# Altium schematic sheet MainPower.SchDoc: Main / high power
size A4; Author: Hildo Guillardi Júnior; Organization: UNICAMP / LCEE; Address1: University of Campinas - Brazil; Address2: Power Conditioning Laboratory; Address3: Licensed by GNU GPL 3.0; ProjectName: Easy Inverter
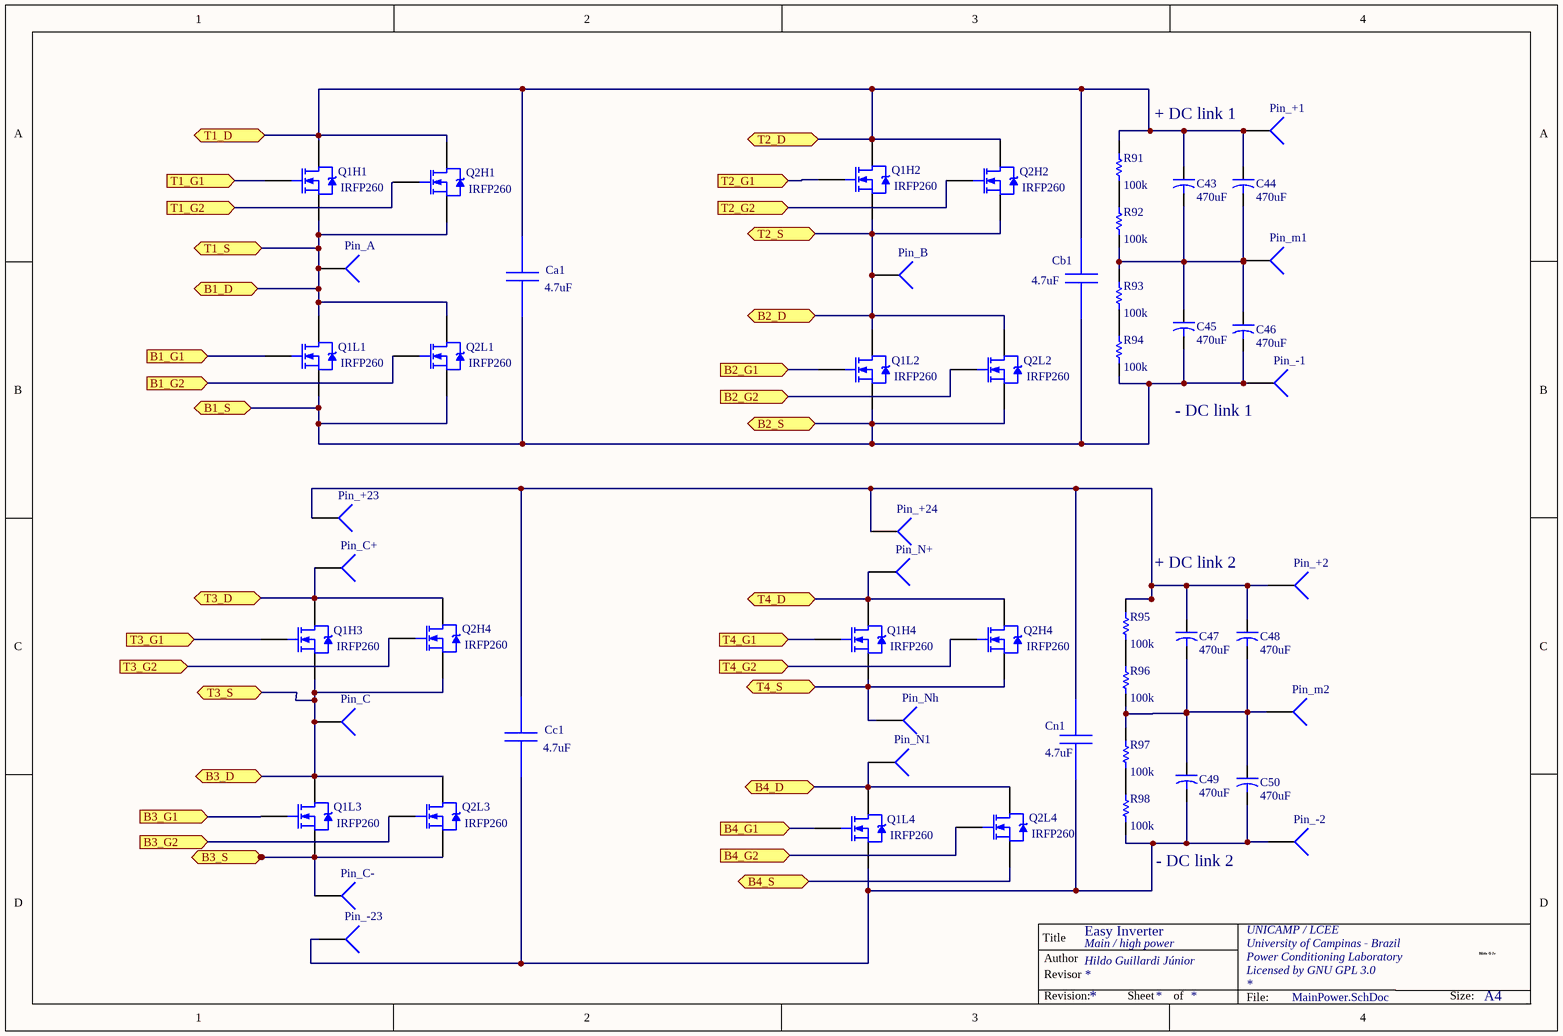
[diagram p0: MainPower.SchDoc]

## Parts
(Parts that share a designator on the sheet are numbered #1, #2 ... from top to bottom, then left to right.)
C43  value 470uF  [Capacitor Eletrolitico - duplicate]
C44  value 470uF  [Capacitor Eletrolitico - duplicate]
C45  value 470uF  [Capacitor Eletrolitico - duplicate]
C46  value 470uF  [Capacitor Eletrolitico - duplicate]
C47  value 470uF  [Capacitor Eletrolitico - duplicate]
C48  value 470uF  [Capacitor Eletrolitico - duplicate]
C49  value 470uF  [Capacitor Eletrolitico - duplicate]
C50  value 470uF  [Capacitor Eletrolitico - duplicate]
Ca1  value 4.7uF  [CApacitor SMD - 22uF]
Cb1  value 4.7uF  [CApacitor SMD - 22uF]
Cc1  value 4.7uF  [CApacitor SMD - 22uF]
Cn1  value 4.7uF  [CApacitor SMD - 22uF]
Pin_+1  (no value)  [Power conector]
Pin_+2  (no value)  [Power conector]
Pin_+23  (no value)  [Power conector]
Pin_+24  (no value)  [Power conector]
Pin_-1  (no value)  [Power conector]
Pin_-2  (no value)  [Power conector]
Pin_-23  (no value)  [Power conector]
Pin_A  (no value)  [Power conector]
Pin_B  (no value)  [Power conector]
Pin_C  (no value)
Pin_C+  (no value)  [Power conector]
Pin_C-  (no value)  [Power conector]
Pin_m1  (no value)  [Power conector]
Pin_m2  (no value)  [Power conector]
Pin_N1  (no value)  [Power conector]
Pin_N+  (no value)  [Power conector]
Pin_Nh  (no value)  [Power conector]
Q1H1  IRFP260  [TO227]
Q1H2  IRFP260  [TO227]
Q1H3  IRFP260  [TO227]
Q1H4  IRFP260  [TO227]
Q1L1  IRFP260  [TO227]
Q1L2  IRFP260  [TO227]
Q1L3  IRFP260  [TO227]
Q1L4  IRFP260  [TO227]
Q2H1  IRFP260  [TO227]
Q2H2  IRFP260  [TO227]
Q2H4#1  IRFP260  [TO227]
Q2H4#2  IRFP260  [TO227]
Q2L1  IRFP260  [TO227]
Q2L2  IRFP260  [TO227]
Q2L3  IRFP260  [TO227]
Q2L4  IRFP260  [TO227]
R91  value 100k  [1210_W]
R92  value 100k  [1210_W]
R93  value 100k  [1210_W]
R94  value 100k  [1210_W]
R95  value 100k  [1210_W]
R96  value 100k  [1210_W]
R97  value 100k  [1210_W]
R98  value 100k  [1210_W]

## Ports
B1_D (bidir), B1_G1 (in), B1_G2 (in), B1_S (bidir), B2_D (bidir), B2_G1 (in), B2_G2 (in), B2_S (bidir), B3_D (bidir), B3_G1 (in), B3_G2 (in), B3_S (bidir), B4_D (bidir), B4_G1 (in), B4_G2 (in), B4_S (bidir), T1_D (bidir), T1_G1 (in), T1_G2 (in), T1_S (bidir), T2_D (bidir), T2_G1 (in), T2_G2 (in), T2_S (bidir), T3_D (bidir), T3_G1 (in), T3_G2 (in), T3_S (bidir), T4_D (bidir), T4_G1 (in), T4_G2 (in), T4_S (bidir)

## Nets
B1_D: Pin_A.1 Q1H1.3(S) Q1L1.2(D) Q2H1.3(S) Q2L1.2(D) ; port B1_D, port T1_S
B1_G1: Q1L1.1(G) ; port B1_G1
B1_G2: Q2L1.1(G) ; port B1_G2
B1_S: C45.2 C46.2 Ca1.2 Cb1.2 Pin_-1.1 Q1L1.3(S) Q1L2.3(S) Q2L1.3(S) Q2L2.3(S) R94.2 ; port B1_S, port B2_S
B2_D: Pin_B.1 Q1H2.3(S) Q1L2.2(D) Q2H2.3(S) Q2L2.2(D) ; port T2_S, port B2_D
B2_G1: Q1L2.1(G) ; port B2_G1
B2_G2: Q2L2.1(G) ; port B2_G2
B3_D: Pin_C.1 Q1H3.3(S) Q1L3.2(D) Q2H4#1.3(S) Q2L3.2(D) ; port T3_S, port B3_D
B3_G1: Q1L3.1(G) ; port B3_G1
B3_G2: Q2L3.1(G) ; port B3_G2
B3_S: Pin_C-.1 Q1L3.3(S) Q2L3.3(S) ; port B3_S
B4_D: Pin_N1.1 Q2L4.2(D) ; port B4_D
B4_G1: Q1L4.1(G) ; port B4_G1
B4_G2: Q2L4.1(G) ; port B4_G2
B4_S: Q2L4.3(S) ; port B4_S
T1_D: C43.1 C44.1 Ca1.1 Cb1.1 Pin_+1.1 Q1H1.2(D) Q1H2.2(D) Q2H1.2(D) Q2H2.2(D) R91.1 ; port T1_D, port T2_D
T1_G1: Q1H1.1(G) ; port T1_G1
T1_G2: Q2H1.1(G) ; port T1_G2
T2_G1: Q1H2.1(G) ; port T2_G1
T2_G2: Q2H2.1(G) ; port T2_G2
T3_D: Pin_C+.1 Q2H4#1.2(D) ; port T3_D
T3_G1: Q1H3.1(G) ; port T3_G1
T3_G2: Q2H4#1.1(G) ; port T3_G2
T4_D: Pin_N+.1 Q1H4.2(D) Q2H4#2.2(D) ; port T4_D
T4_G1: Q1H4.1(G) ; port T4_G1
T4_G2: Q2H4#2.1(G) ; port T4_G2
T4_S: Pin_Nh.1 Q1H4.3(S) Q2H4#2.3(S) ; port T4_S
NetC43_2: C43.2 C44.2 C45.1 C46.1 Pin_m1.1 R92.2 R93.1
NetC47_1: C47.1 C48.1 Cc1.1 Cn1.1 Pin_+2.1 Pin_+23.1 Pin_+24.1 R95.1
NetC47_2: C47.2 C48.2 C49.1 C50.1 Pin_m2.1 R96.2 R97.1
NetC49_2: C49.2 C50.2 Cc1.2 Cn1.2 Pin_-2.1 Pin_-23.1 Q1L4.3(S) R98.2
NetR91_2: R91.2 R92.1
NetR93_2: R93.2 R94.1
NetR95_2: R95.2 R96.1
NetR97_2: R97.2 R98.1

Not connected (* = marked no-connect by the designer): Q1H3 2(D); Q1L4 2(D)

## Notes on the sheet
- (near Pin_+1) + DC link 1
- (near Pin_-1) - DC link 1
- + DC link 2
- - DC link 2
- Title
- Author
- Revisor
- Hildo G Jr
- Revision:
- Sheet
- of
- File:
- Size:
- A4
- HGJr

## Library data of the parts
C43-C50 = Cap2: Capacitor; PackageReference: CAPR5-4X5; Published: 23-Sep-2002; Publisher: Altium Limited; PackageDescription: Capacitor; 2 Leads
Ca1 Cb1 Cc1 Cn1 = GRM21BC81E475KA12L: Manufacturer Name: MuRata; PackageReference: GRM21BC81E475KA12L; Manufacturer Part Number: GRM21BC81E475KA12L
Pin_+1 Pin_+2 Pin_+23 Pin_+24 Pin_-1 Pin_-2 Pin_-23 Pin_A Pin_B Pin_C Pin_C+ Pin_C- Pin_m1 Pin_m2 Pin_N1 Pin_N+ Pin_Nh = Socket: pn: 7799; Value: screw
Q1H1-Q1H4 Q1L1-Q1L4 Q2H1 Q2H2 Q2H4#1 Q2H4#2 Q2L1-Q2L4 = IRFP260: HEXFET Power MOSFET; pn: 4180G; RM3X10MM 2701; IRFP260MPBF; 28N65M2; C3M0280090D; Value: IRFP260
R91-R98 = Res_0805: Resistor; Manufacturer: Generic Components; Class: Passive; Published: 08/06/2000; Publisher: Altium Hobart Technology Centre; SubClass: Resistor